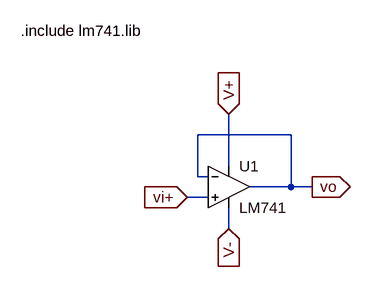
[diagram p0: schematic VoltageFollower.asc]
VoltageFollower.asc, the LTspice schematic file:
Version 4.1
SHEET 1 880 680
WIRE 128 -16 -16 -16
WIRE 32 32 32 -48
WIRE -16 48 -16 -16
WIRE 0 48 -16 48
WIRE 128 64 128 -16
WIRE 128 64 64 64
WIRE 160 64 128 64
WIRE 0 80 -32 80
WIRE 32 128 32 96
FLAG -32 80 vi+
IOPIN -32 80 In
FLAG 32 -48 V+
IOPIN 32 -48 In
FLAG 32 128 V-
IOPIN 32 128 In
FLAG 160 64 vo
IOPIN 160 64 Out
SYMBOL OpAmps\\opamp2 32 0 R0
SYMATTR InstName U1
SYMATTR Value LM741
TEXT -288 -176 Left 2 !.include lm741.lib

The netlist it stands for:
* VoltageFollower.asc
X§U1 vi+ vo V+ V- vo LM741  ; pins In+ In- V+ V- OUT
.include lm741.lib
.backanno
.end